# Altium project STM32F103C8T6.PrjPcb
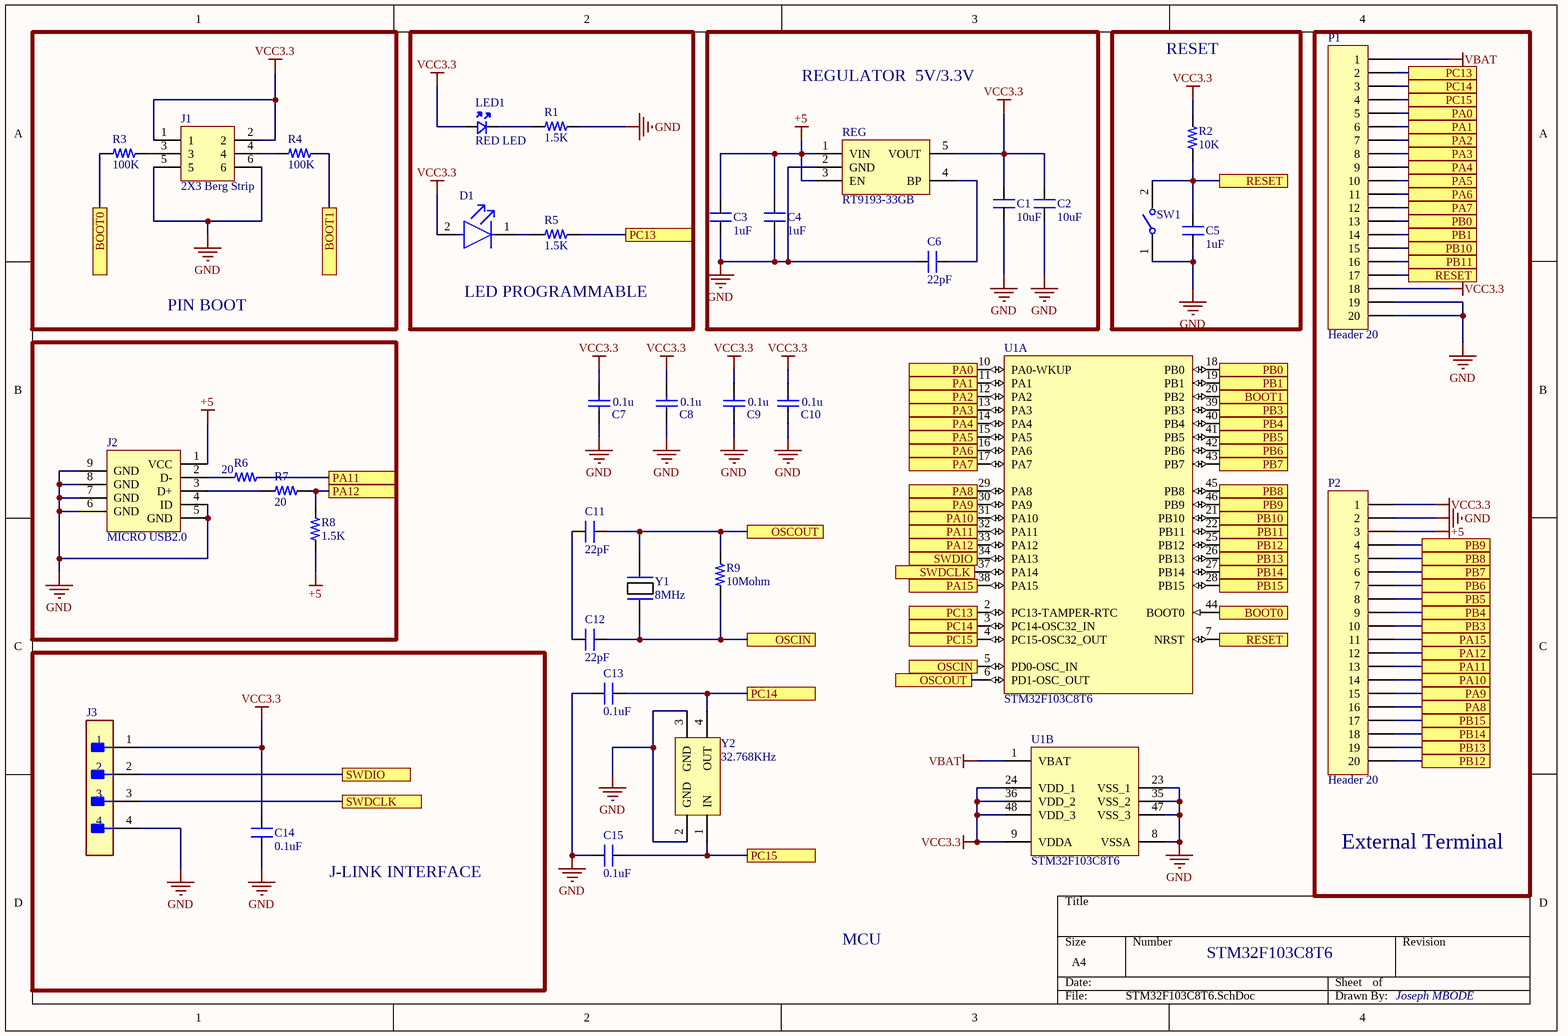
[diagram p0: STM32F103C8T6.SchDoc]
1 sheet, 36 parts. Net scope: flat (ports and power ports of the same name join across sheets).
Board file: STM32F103C8T6.PcbDoc

## Sheet STM32F103C8T6.SchDoc: STM32F10C8T6
size A4; DrawnBy: Joseph; SheetNumber: 1; SheetTotal: 1

### Parts
C1  10uF  [CAP_0805]
C2  10uF  [CAP_0805]
C3  1uF  [CAP_0805]
C4  1uF  [CAP_0805]
C5  1uF  [CAP_0805]
C6  22pF  [CAP_0805]
C7  0.1u  [CAPC0402(1005)60_L]
C8  0.1u  [CAPC0402(1005)60_L]
C9  0.1u  [CAPC0402(1005)60_L]
C10  0.1u  [CAPC0402(1005)60_L]
C11  22pF  [CAP_0805]
C12  22pF  [CAP_0805]
C13  0.1uF  [CAP_0805]
C14  0.1uF  [CAP_0805]
C15  0.1uF  [CAP_0805]
D1  LED BLUE  [FP-APHCM2012QBC-D-F01-MFG]  (value not drawn)
J1  2X3 Berg Strip  [CON6_100_59D78_TH_ST_Duplicate]
J2  MICRO USB2.0  [CON_10118192-0001LF_SMD]
J3  TMM-104-01-L-S-RA  [FP-TMM-104-01-L-S-RA-MFG]  (value not drawn)
LED1  RED LED  [LED_0805]
P1  Header 20  [HDR1X20]
P2  Header 20  [HDR1X20]
R1  1.5K  [RES_0805]
R2  10K  [RES_0805]
R3  100K  [RES_0805]
R4  100K  [RES_0805]
R5  1.5K  [RES_0805]
R6  20  [RES_0805]
R7  20  [RES_0805]
R8  1.5K  [RES_0805]
R9  10Mohm  [RES_0805]
REG  RT9193-33GB  [SOT23-5]
SW1  B3U-1000P  [FP-B3U-1000P-MFG]  (value not drawn)
U1  STM32F103C8T6  [STM-LQFP48_L]  (parts A,B of 2)
Y1  8MHz  [XTAL_314_240X47_SMD]
Y2  32.768KHz  [XTAL_MC-405 32.7680K-G3]

### Blocks framed on the sheet
PIN BOOT: J1 R3 R4
LED PROGRAMMABLE: D1 LED1 R1 R5
REGULATOR  5V/3.3V: C1-C4 C6 REG
RESET: C5 R2 SW1
External Terminal: P1 P2
J-LINK INTERFACE: C14 J3

### Ports
BOOT0 (see STM32F103C8T6[1B]), BOOT0 (see STM32F103C8T6[4C]), BOOT1 (see STM32F103C8T6[1B]), BOOT1 (see STM32F103C8T6[4B]), OSCIN (see STM32F103C8T6[2C]), OSCIN (see STM32F103C8T6[3C]), OSCOUT (see STM32F103C8T6[2C]), OSCOUT (see STM32F103C8T6[3C]), PA0 (see STM32F103C8T6[3B]), PA0 (see STM32F103C8T6[4A]), PA1 (see STM32F103C8T6[3B]), PA1 (see STM32F103C8T6[4A]), PA2 (see STM32F103C8T6[3B]), PA2 (see STM32F103C8T6[4A]), PA3 (see STM32F103C8T6[3B]), PA3 (see STM32F103C8T6[4A]), PA4 (see STM32F103C8T6[3B]), PA4 (see STM32F103C8T6[4A]), PA5 (see STM32F103C8T6[3B]), PA5 (see STM32F103C8T6[4A]), PA6 (see STM32F103C8T6[3B]), PA6 (see STM32F103C8T6[4A]), PA7 (see STM32F103C8T6[3B]), PA7 (see STM32F103C8T6[4A]), PA8 (see STM32F103C8T6[3B]), PA8 (see STM32F103C8T6[4C]), PA9 (see STM32F103C8T6[3B]), PA9 (see STM32F103C8T6[4C]), PA10 (see STM32F103C8T6[3C]), PA10 (see STM32F103C8T6[4C]), PA11 (see STM32F103C8T6[1B], STM32F103C8T6[3C]), PA11 (see STM32F103C8T6[1B], STM32F103C8T6[4C]), PA11 (see STM32F103C8T6[3C], STM32F103C8T6[4C]), PA12 (see STM32F103C8T6[1B], STM32F103C8T6[3C]), PA12 (see STM32F103C8T6[1B], STM32F103C8T6[4C]), PA12 (see STM32F103C8T6[3C], STM32F103C8T6[4C]), PA15 (see STM32F103C8T6[3C]), PA15 (see STM32F103C8T6[4C]), PB0 (see STM32F103C8T6[4A]), PB0 (see STM32F103C8T6[4B]), PB1 (see STM32F103C8T6[4A]), PB1 (see STM32F103C8T6[4B]), PB3 (see STM32F103C8T6[4B]), PB3 (see STM32F103C8T6[4C]), PB4 (see STM32F103C8T6[4B]), PB4 (see STM32F103C8T6[4C]), PB5 (see STM32F103C8T6[4B]), PB5 (see STM32F103C8T6[4C]), PB6 (see STM32F103C8T6[4B]), PB6 (see STM32F103C8T6[4C]), PB7 (see STM32F103C8T6[4B]), PB7 (see STM32F103C8T6[4C]), PB8 (see STM32F103C8T6[4B]), PB8 (see STM32F103C8T6[4C]), PB9 (see STM32F103C8T6[4B]), PB9 (see STM32F103C8T6[4C]), PB10 (see STM32F103C8T6[4A]), PB10 (see STM32F103C8T6[4C]), PB11 (see STM32F103C8T6[4B]), PB11 (see STM32F103C8T6[4C]), PB12 (see STM32F103C8T6[4C]), PB13 (see STM32F103C8T6[4C]), PB14 (see STM32F103C8T6[4C]), PB15 (see STM32F103C8T6[4C]), PC13 (see STM32F103C8T6[2A], STM32F103C8T6[3C]), PC13 (see STM32F103C8T6[2A], STM32F103C8T6[4A]), PC13 (see STM32F103C8T6[3C], STM32F103C8T6[4A]), PC14 (see STM32F103C8T6[2C], STM32F103C8T6[3C]), PC14 (see STM32F103C8T6[2C], STM32F103C8T6[4A]), PC14 (see STM32F103C8T6[3C], STM32F103C8T6[4A]), PC15 (see STM32F103C8T6[2D], STM32F103C8T6[3C]), PC15 (see STM32F103C8T6[2D], STM32F103C8T6[4A]), PC15 (see STM32F103C8T6[3C], STM32F103C8T6[4A]), RESET (see STM32F103C8T6[4A], STM32F103C8T6[4B]), RESET (see STM32F103C8T6[4A], STM32F103C8T6[4C]), RESET (see STM32F103C8T6[4B], STM32F103C8T6[4C]), SWDCLK (see STM32F103C8T6[1D]), SWDCLK (see STM32F103C8T6[3C]), SWDIO (see STM32F103C8T6[1D]), SWDIO (see STM32F103C8T6[3C])

### Nets
+5: C3.2 C4.2 J2.1(VCC) P2.3 R8.1 REG.1(VIN) REG.3(EN)
GND: C1.1 C2.1 C3.1 C4.1 C5.1 C6.1 C7.1 C8.1 C9.1 C10.1 C13.1 C14.1 C15.1 J1.5 J1.6 J2.4(ID) J2.5(GND) J2.6(GND) J2.7(GND) J2.8(GND) J2.9(GND) J3.4 P1.19 P1.20 P2.2 R1.2 REG.2(GND) SW1.1 U1.8(VSSA) U1.23(VSS_1) U1.35(VSS_2) U1.47(VSS_3) Y2.2(GND) Y2.3(GND)
VBAT: P1.1 U1.1(VBAT)
VCC3.3: C1.2 C2.2 C7.2 C8.2 C9.2 C10.2 C14.2 D1.2(A) J1.1 J1.2 J3.1 LED1.A P1.18 P2.1 R2.2 REG.5(VOUT) U1.9(VDDA) U1.24(VDD_1) U1.36(VDD_2) U1.48(VDD_3)
NetC5_2: C5.2 P1.17 R2.1 SW1.2 U1.7(NRST) ; port RESET
NetC6_2: C6.2 REG.4(BP)
NetC11_1: C11.1 C12.1
NetC11_2: C11.2 R9.2 U1.6(PD1-OSC_OUT) Y1.2 ; port OSCOUT
NetC12_2: C12.2 R9.1 U1.5(PD0-OSC_IN) Y1.1 ; port OSCIN
NetC13_2: C13.2 P1.3 U1.3(PC14-OSC32_IN) Y2.4(OUT) ; port PC14
NetC15_2: C15.2 P1.4 U1.4(PC15-OSC32_OUT) Y2.1(IN) ; port PC15
NetD1_1: D1.1(C) R5.1
NetJ1_3: J1.3 R3.2
NetJ1_4: J1.4 R4.1
NetJ2_2: J2.2(D-) R6.1
NetJ2_3: J2.3(D+) R7.1
NetJ3_2: J3.2 U1.34(PA13) ; port SWDIO
NetJ3_3: J3.3 U1.37(PA14) ; port SWDCLK
NetLED1_K: LED1.K R1.1
NetP1_2: P1.2 R5.2 U1.2(PC13-TAMPER-RTC) ; port PC13
NetP1_5: P1.5 U1.10(PA0-WKUP) ; port PA0
NetP1_6: P1.6 U1.11(PA1) ; port PA1
NetP1_7: P1.7 U1.12(PA2) ; port PA2
NetP1_8: P1.8 U1.13(PA3) ; port PA3
NetP1_9: P1.9 U1.14(PA4) ; port PA4
NetP1_10: P1.10 U1.15(PA5) ; port PA5
NetP1_11: P1.11 U1.16(PA6) ; port PA6
NetP1_12: P1.12 U1.17(PA7) ; port PA7
NetP1_13: P1.13 U1.18(PB0) ; port PB0
NetP1_14: P1.14 U1.19(PB1) ; port PB1
NetP1_15: P1.15 U1.21(PB10) ; port PB10
NetP1_16: P1.16 U1.22(PB11) ; port PB11
NetP2_4: P2.4 U1.46(PB9) ; port PB9
NetP2_5: P2.5 U1.45(PB8) ; port PB8
NetP2_6: P2.6 U1.43(PB7) ; port PB7
NetP2_7: P2.7 U1.42(PB6) ; port PB6
NetP2_8: P2.8 U1.41(PB5) ; port PB5
NetP2_9: P2.9 U1.40(PB4) ; port PB4
NetP2_10: P2.10 U1.39(PB3) ; port PB3
NetP2_11: P2.11 U1.38(PA15) ; port PA15
NetP2_12: P2.12 R7.2 R8.2 U1.33(PA12) ; port PA12
NetP2_13: P2.13 R6.2 U1.32(PA11) ; port PA11
NetP2_14: P2.14 U1.31(PA10) ; port PA10
NetP2_15: P2.15 U1.30(PA9) ; port PA9
NetP2_16: P2.16 U1.29(PA8) ; port PA8
NetP2_17: P2.17 U1.28(PB15) ; port PB15
NetP2_18: P2.18 U1.27(PB14) ; port PB14
NetP2_19: P2.19 U1.26(PB13) ; port PB13
NetP2_20: P2.20 U1.25(PB12) ; port PB12
NetR3_1: R3.1 U1.44(BOOT0) ; port BOOT0
NetR4_2: R4.2 U1.20(PB2) ; port BOOT1

### Notes on the sheet
- MCU
- STM32F103C8T6
- Joseph MBODE

### Library data of the parts
C1-C5 = CAP_1uF-50V-5%-0805: 1µF ±5% 50V Ceramic Capacitor X7R 0805 (2012 Metric); Manufacturer: Yageo; Manufacturing Part Number: CC0805JKX7R9BB105; Case/Package: 0805 (2012 Metric); Supplier-1: Digikey; Supplier Part Number-1: 311-3498-1-ND
C6 C11 C12 = CAP_22pF-50V-5%-0805: 22pF ±5% 50V Ceramic Capacitor C0G, NP0 0805 (2012 Metric); Manufacturer: KEMET; Manufacturer Part Number: C0805C220J5GACTU; Case/Package: 0805; Supplier-1: Digikey; Supplier Part Number-1: 399-1113-1-ND
C7-C10 = CMP-1034-02112-1: CAP 1uF 4V ±20% 0402 (1005 Metric) Thickness 0.6mm SMD; Case-Metric: 1005; Case-EIA: 0402; Tolerance: Â±20%; Value: 0.1u; Technology: SMT; Max Thickness: 0.6 mm; Rated Voltage: 4 V
C13-C15 = CAP_0.1uF-50V-5%-0805: 0.1µF ±5% 50V Ceramic Capacitor X7R 0805 (2012 Metric); Manufacturer: KEMET; Manufacturing Part Number: C0805C104J5RACTU; Case/Package: 0805 (2012 Metric); Supplier-1: Digikey; Supplier Part Number-1: 399-1171-1-ND
D1 = CMP-44529-000061-1: LED BLUE CLEAR CHIP SMD; Forward Current: 20mA; Viewing Angle: 110°; Dominant Wavelength: 465nm; Luminous Intensity: 100mcd; Number of LEDs: 1; Forward Voltage: 3.3V; Lens Color: Colorless; Packaging: Tape and Reel; Color: Blue; Length: 2mm; Case Code (Metric): 2012; Case Code (Imperial): 0805; Illumination Color: Blue; Width: 1.25mm; Mount: Surface Mount; Series: -; Height: 0.4mm; Case/Package: 0805; Package Quantity: 2000; Test Current: 20mA; Lead Free: Lead Free; Number of Pins: 2; Min Operating Temperature: -40°C; Lens Transparency: Clear; Lens Style: Clear; RoHS Compliant: Yes; Max Operating Temperature: 85°C
J1 = CON-BS-PLG_2X3-100-TH-ST: 6 pin, 2 row, 2.54mm pitch bergstrip; Manufacturer: NA; Manufacturer Part Number: NA; Case/Package: TH; Supplier-1: NA; Supplier Part Number-1: NA
J2 = CON-USB_10118192-0002LF-SMD: USB - micro B USB 2.0 Receptacle Connector 5 Position Surface Mount, Right Angle; Manufacturer: Amphenol ICC (FCI); Manufacturing Part Number: 10118192-0002LF; Case/Package: SMD; Supplier-1: Digikey; Supplier Part Number-1: 609-5379-1-ND
J3 = CMP-02766-001710-1: CONN HEADER R/A 4POS 2MM; Number of Contacts: 4; Max Voltage Rating (AC): 500V; Max Current Rating: 3.9A; Gender: Male; Housing Color: Black; Termination: Solder; Max Operating Temperature: 125°C; Packaging: Bulk; Lead Free: Lead Free; Min Operating Temperature: -55°C; Number of Rows: 1; Length: 8mm; REACH SVHC: No SVHC; Housing Material: Polymer; Orientation: Right Angle; RoHS Compliant: Yes; Radiation Hardening: No; Depth: 5.97mm; Pitch: 2mm; Contact Plating: Gold; Contact Material: Bronze
LED1 = LED-RED_10mA-0805: Red 621nm LED Indication - Discrete 2V 0805 (2012 Metric); Manufacturer: Lite-On Inc.; Manufacturer Part Number: LTST-C170EKT; Case/ Package: 0805; Supplier-1: Digikey; Supplier Part Number-1: 160-1178-1-ND
P1 P2 = Header 20: Header, 20-Pin; LatestRevisionDate: 17-Jul-2002; LatestRevisionNote: Re-released for DXP Platform.; Publisher: Altium Limited
R1 R5-R8 = RES_1.5K-0.125W-1%-0805: 1.5 kOhms ±1% 0.125W, 1/8W Chip Resistor 0805 (2012 Metric) Thick Film; Manufacturer: TE Connectivity Passive Product; Manufacturing Part Number: CRG0805F1K5; Case/Package: 0805; Supplier-1: Digikey; Supplier Part Number-1: A106057CT-ND
R2-R4 = RES_10K-0.125W-1%-0805: 10 kOhms ±1% 0.125W, 1/8W Chip Resistor 0805 (2012 Metric) Moisture Resistant Thick Film; Manufacturer: Yageo; Manufacturing Part Number: RC0805FR-0710KL; Case/Package: 0805; Supplier-1: Digikey; Supplier Part Number-1: 311-10.0KCRCT-ND
R9 = RES_10MOHM-0.125W-1%-0805: 10 MOhms ±1% 0.125W, 1/8W Chip Resistor 0805 (2012 Metric) Automotive AEC-Q200, High Voltage Thick Film; Manufacturer: Rohm Semiconductor; Manufacturing Part Number: KTR10EZPF1005; Case/Package: 0805 (2012 Metric); Supplier-1: Digikey; Supplier Part Number-1: RHM10.0MAHCT-ND
REG = REG_3.3V-5.5V-0.3A-SOT-23-5: Linear Voltage Regulator IC 1 Output 300mA SOT-23-5; Manufacturer: Richtek USA Inc.; Manufacturer Part Number: RT9193-33GB; Case/ Package: SOT-23-5; Supplier-1: Digikey; Supplier Part Number-1: 1028-1014-1-ND
SW1 = CMP-2100-03586-2: SWITCH TACTILE SPST-NO 0.05A 12V; Contact Resistance: 100mR; Operating Force: 1.5N; Max Current Rating: 50mA; Switch Travel: 0.15mm; Actuator Type: Standard; Mechanical Life: 200000Cycles; Ratings: Dust Proof; Illumination Type: Non-Illuminated; Throw Configuration: SPST; Actuator Length: 0.4mm; Switch Function: Off-Mom; Height: 1.2mm; Width: 3mm; Weight: 0.000776oz; Contact Material: Silver; Max Voltage Rating (DC): 12V; Insulation Resistance: 100MR; Lead Free: Lead Free; Current Rating: 50mA; Termination: SMD/SMT; Length: 4mm; Voltage Rating (DC): 12V; Contact Current Rating: 50mA; Orientation: Straight; Depth: 2.5mm; Max Operating Temperature: 70°C; Packaging: Tape and Reel; Min Operating Temperature: -25°C; Package Quantity: 1; Mount: Surface Mount; Electrical Life: 200000Cycles
U1 = CMP-0237-00215-3: ARM Cortex-M3 32-bit MCU, 64 KB Flash, 20 KB Internal RAM, 37 I/Os, 48-pin LQFP, -40 to 85 degC, Tray; Supply Voltage(Vcc) min (V): 2; Internal RAM Size (kB): 20; FLASH Size (Prog) (kB): 64; A/D Converter: 2x12-bit (10 Channel); I/Os (High Current): 37; Operating Frequency(F) (Processor speed) (MHz): 72; Core: ARM Cortex-M3; ComponentLink3Description: Package Specification; Mounting Technology: Surface Mount; PartNumber: STM32F103C8T6; PackageReference: LQFP48; Packing: Tray; ComponentLink3URL: http://www.st.com/st-web-ui/static/active/en/resource/technical/document/datasheet/DM00058181.pdf; DatasheetVersion: Rev. 16; ComponentLink1URL: http://www.st.com/web/en/home.html; PackageVersion: Rev. 6, 06/2013; ComponentLink2URL: http://www.st.com/st-web-ui/static/active/en/resource/technical/document/datasheet/CD00161566.pdf; ComponentLink1Description: Manufacturer URL; ComponentLink2Description: Datasheet; PackageDescription: 48-Pin Low Profile Quad Flat Package, 7 x 7 mm Body, 0.5 mm Pitch
Y1 = XTAL_8MHZ-LFXTAL030234: Crystals 8MHz 22pF -20C 70C; Manufacturer: IQD Frequency Products; Manufacturing Part Number: LFXTAL030234Reel; Case/Package: SMD; Supplier-1: Mouser; Supplier Part Number-1: 449-LFXTAL030234REEL
Y2 = XTAL_32.768KHz-MC-405 32.7680K-G3: Crystals SMD AT XTL MHZ +/-50PPM 12.5 PF 250 T/R; Manufacturer: Epson; Manufacturing Part Number: MC-405 32.7680K-G3: ROHS; Case/Package: SMD; Supplier-1: Mouser; Supplier Part Number-1: 732-MC405327680KG3RS